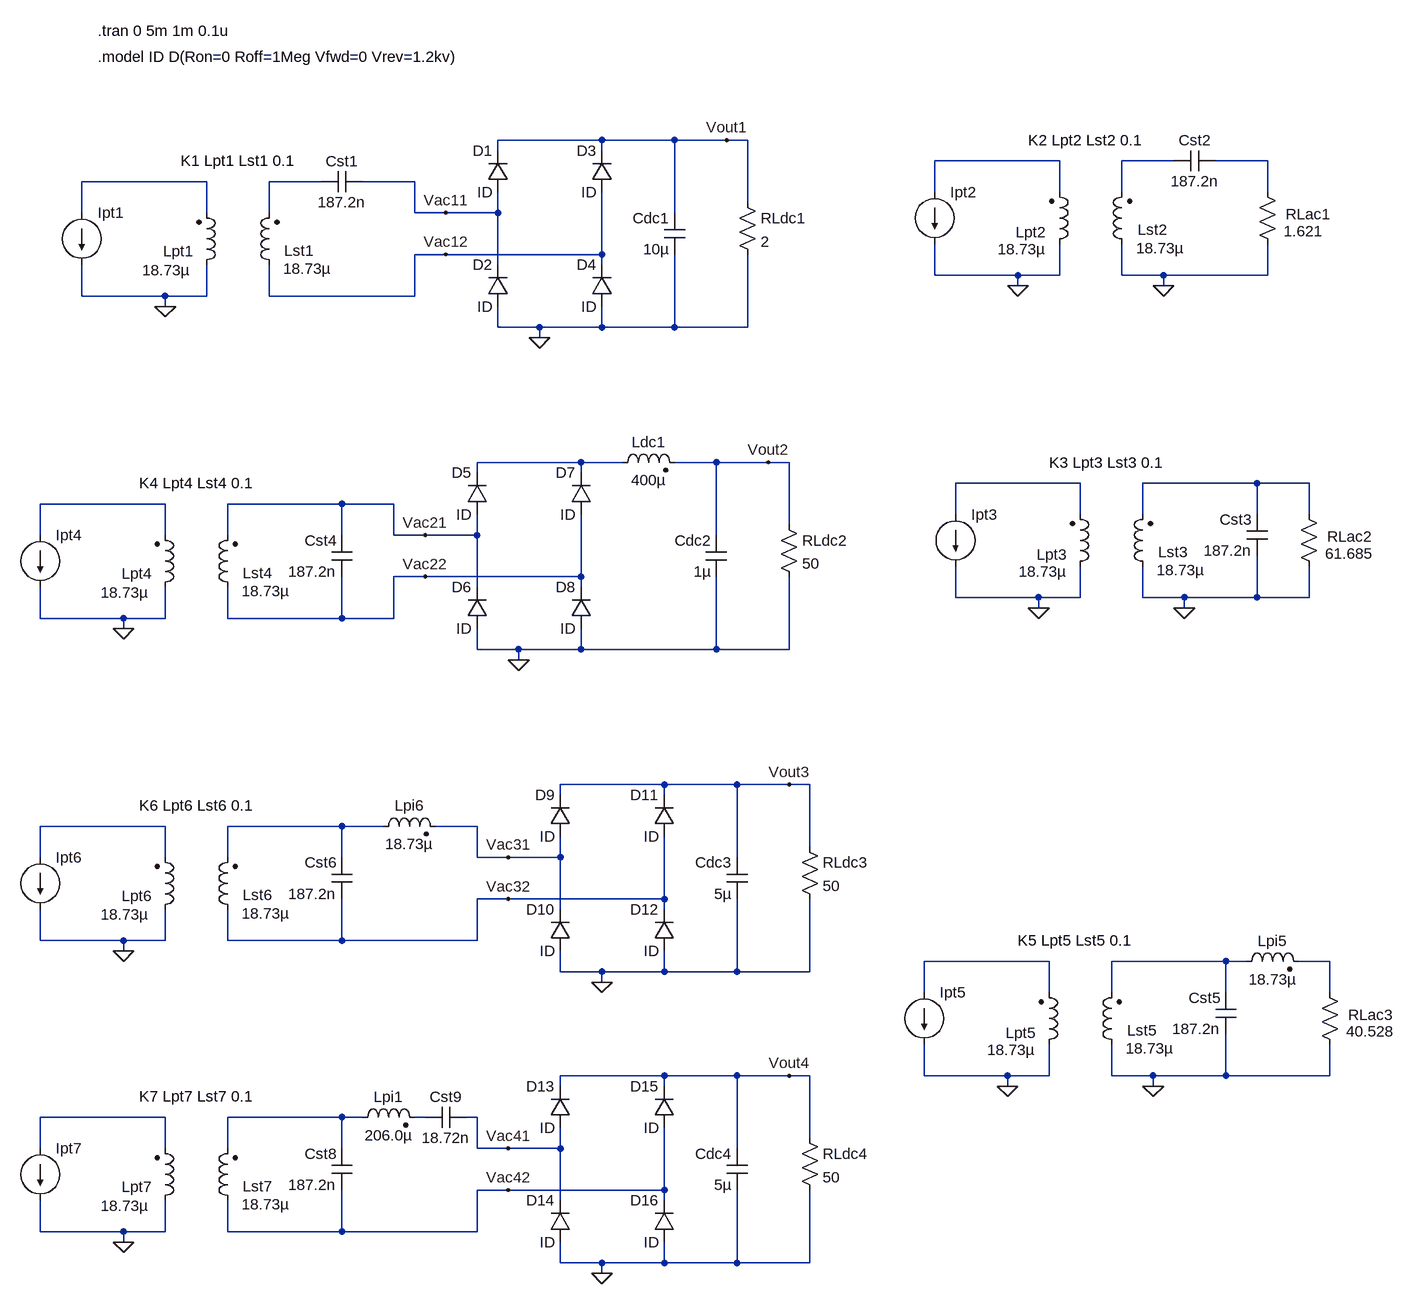
[diagram p0: schematic Rac.asc]
Rac.asc, the LTspice schematic file:
Version 4
SHEET 1 2108 1984
WIRE 800 224 640 224
WIRE 912 224 800 224
WIRE 992 224 912 224
WIRE 1024 224 992 224
WIRE 640 240 640 224
WIRE 800 240 800 224
WIRE 1504 256 1312 256
WIRE 1680 256 1600 256
WIRE 1824 256 1744 256
WIRE 192 288 0 288
WIRE 368 288 288 288
WIRE 512 288 432 288
WIRE 1312 304 1312 256
WIRE 1504 304 1504 256
WIRE 1600 304 1600 256
WIRE 1824 304 1824 256
WIRE 1024 320 1024 224
WIRE 0 336 0 288
WIRE 192 336 192 288
WIRE 288 336 288 288
WIRE 512 336 512 288
WIRE 560 336 512 336
WIRE 640 336 640 304
WIRE 640 336 560 336
WIRE 912 336 912 224
WIRE 560 400 512 400
WIRE 800 400 800 304
WIRE 800 400 560 400
WIRE 640 416 640 336
WIRE 800 416 800 400
WIRE 1312 432 1312 384
WIRE 1440 432 1312 432
WIRE 1504 432 1504 384
WIRE 1504 432 1440 432
WIRE 1600 432 1600 384
WIRE 1664 432 1600 432
WIRE 1824 432 1824 384
WIRE 1824 432 1664 432
WIRE 1440 448 1440 432
WIRE 1664 448 1664 432
WIRE 0 464 0 416
WIRE 128 464 0 464
WIRE 192 464 192 416
WIRE 192 464 128 464
WIRE 288 464 288 416
WIRE 512 464 512 400
WIRE 512 464 288 464
WIRE 128 480 128 464
WIRE 640 512 640 480
WIRE 704 512 640 512
WIRE 800 512 800 480
WIRE 800 512 704 512
WIRE 912 512 912 400
WIRE 912 512 800 512
WIRE 1024 512 1024 400
WIRE 1024 512 912 512
WIRE 704 528 704 512
WIRE 768 720 608 720
WIRE 832 720 768 720
WIRE 976 720 912 720
WIRE 1056 720 976 720
WIRE 1088 720 1056 720
WIRE 608 736 608 720
WIRE 768 736 768 720
WIRE 1536 752 1344 752
WIRE 1808 752 1632 752
WIRE 1888 752 1808 752
WIRE 128 784 -64 784
WIRE 400 784 224 784
WIRE 480 784 400 784
WIRE 1344 800 1344 752
WIRE 1536 800 1536 752
WIRE 1632 800 1632 752
WIRE 1808 800 1808 752
WIRE 1888 800 1888 752
WIRE 1088 816 1088 720
WIRE -64 832 -64 784
WIRE 128 832 128 784
WIRE 224 832 224 784
WIRE 400 832 400 784
WIRE 480 832 480 784
WIRE 528 832 480 832
WIRE 608 832 608 800
WIRE 608 832 528 832
WIRE 976 832 976 720
WIRE 528 896 480 896
WIRE 768 896 768 800
WIRE 768 896 528 896
WIRE 608 912 608 832
WIRE 768 912 768 896
WIRE 1344 928 1344 880
WIRE 1472 928 1344 928
WIRE 1536 928 1536 880
WIRE 1536 928 1472 928
WIRE 1632 928 1632 880
WIRE 1696 928 1632 928
WIRE 1808 928 1808 864
WIRE 1808 928 1696 928
WIRE 1888 928 1888 880
WIRE 1888 928 1808 928
WIRE 1472 944 1472 928
WIRE 1696 944 1696 928
WIRE -64 960 -64 912
WIRE 64 960 -64 960
WIRE 128 960 128 912
WIRE 128 960 64 960
WIRE 224 960 224 912
WIRE 400 960 400 896
WIRE 400 960 224 960
WIRE 480 960 480 896
WIRE 480 960 400 960
WIRE 64 976 64 960
WIRE 608 1008 608 976
WIRE 672 1008 608 1008
WIRE 768 1008 768 976
WIRE 768 1008 672 1008
WIRE 976 1008 976 896
WIRE 976 1008 768 1008
WIRE 1088 1008 1088 896
WIRE 1088 1008 976 1008
WIRE 672 1024 672 1008
WIRE 896 1216 736 1216
WIRE 1008 1216 896 1216
WIRE 1088 1216 1008 1216
WIRE 1120 1216 1088 1216
WIRE 736 1232 736 1216
WIRE 896 1232 896 1216
WIRE 128 1280 -64 1280
WIRE 400 1280 224 1280
WIRE 464 1280 400 1280
WIRE 608 1280 544 1280
WIRE 1120 1312 1120 1216
WIRE -64 1328 -64 1280
WIRE 128 1328 128 1280
WIRE 224 1328 224 1280
WIRE 400 1328 400 1280
WIRE 608 1328 608 1280
WIRE 656 1328 608 1328
WIRE 736 1328 736 1296
WIRE 736 1328 656 1328
WIRE 1008 1328 1008 1216
WIRE 656 1392 608 1392
WIRE 896 1392 896 1296
WIRE 896 1392 656 1392
WIRE 736 1408 736 1328
WIRE 896 1408 896 1392
WIRE -64 1456 -64 1408
WIRE 64 1456 -64 1456
WIRE 128 1456 128 1408
WIRE 128 1456 64 1456
WIRE 224 1456 224 1408
WIRE 400 1456 400 1392
WIRE 400 1456 224 1456
WIRE 608 1456 608 1392
WIRE 608 1456 400 1456
WIRE 64 1472 64 1456
WIRE 1488 1488 1296 1488
WIRE 1760 1488 1584 1488
WIRE 1792 1488 1760 1488
WIRE 1920 1488 1872 1488
WIRE 736 1504 736 1472
WIRE 800 1504 736 1504
WIRE 896 1504 896 1472
WIRE 896 1504 800 1504
WIRE 1008 1504 1008 1392
WIRE 1008 1504 896 1504
WIRE 1120 1504 1120 1392
WIRE 1120 1504 1008 1504
WIRE 800 1520 800 1504
WIRE 1296 1536 1296 1488
WIRE 1488 1536 1488 1488
WIRE 1584 1536 1584 1488
WIRE 1760 1536 1760 1488
WIRE 1920 1536 1920 1488
WIRE 896 1664 736 1664
WIRE 1008 1664 896 1664
WIRE 1088 1664 1008 1664
WIRE 1120 1664 1088 1664
WIRE 1296 1664 1296 1616
WIRE 1424 1664 1296 1664
WIRE 1488 1664 1488 1616
WIRE 1488 1664 1424 1664
WIRE 1584 1664 1584 1616
WIRE 1648 1664 1584 1664
WIRE 1760 1664 1760 1600
WIRE 1760 1664 1648 1664
WIRE 1920 1664 1920 1616
WIRE 1920 1664 1760 1664
WIRE 736 1680 736 1664
WIRE 896 1680 896 1664
WIRE 1424 1680 1424 1664
WIRE 1648 1680 1648 1664
WIRE 128 1728 -64 1728
WIRE 400 1728 224 1728
WIRE 432 1728 400 1728
WIRE 528 1728 512 1728
WIRE 608 1728 592 1728
WIRE 1120 1760 1120 1664
WIRE -64 1776 -64 1728
WIRE 128 1776 128 1728
WIRE 224 1776 224 1728
WIRE 400 1776 400 1728
WIRE 608 1776 608 1728
WIRE 656 1776 608 1776
WIRE 736 1776 736 1744
WIRE 736 1776 656 1776
WIRE 1008 1776 1008 1664
WIRE 656 1840 608 1840
WIRE 896 1840 896 1744
WIRE 896 1840 656 1840
WIRE 736 1856 736 1776
WIRE 896 1856 896 1840
WIRE -64 1904 -64 1856
WIRE 64 1904 -64 1904
WIRE 128 1904 128 1856
WIRE 128 1904 64 1904
WIRE 224 1904 224 1856
WIRE 400 1904 400 1840
WIRE 400 1904 224 1904
WIRE 608 1904 608 1840
WIRE 608 1904 400 1904
WIRE 64 1920 64 1904
WIRE 736 1952 736 1920
WIRE 800 1952 736 1952
WIRE 896 1952 896 1920
WIRE 896 1952 800 1952
WIRE 1008 1952 1008 1840
WIRE 1008 1952 896 1952
WIRE 1120 1952 1120 1840
WIRE 1120 1952 1008 1952
WIRE 800 1968 800 1952
FLAG 1440 448 0
FLAG 1664 448 0
FLAG 128 480 0
FLAG 704 528 0
FLAG 992 224 Vout1
FLAG 560 336 Vac11
FLAG 560 400 Vac12
FLAG 1472 944 0
FLAG 1696 944 0
FLAG 64 976 0
FLAG 672 1024 0
FLAG 1056 720 Vout2
FLAG 528 832 Vac21
FLAG 528 896 Vac22
FLAG 1424 1680 0
FLAG 1648 1680 0
FLAG 64 1472 0
FLAG 800 1520 0
FLAG 1088 1216 Vout3
FLAG 656 1328 Vac31
FLAG 656 1392 Vac32
FLAG 64 1920 0
FLAG 800 1968 0
FLAG 1088 1664 Vout4
FLAG 656 1776 Vac41
FLAG 656 1840 Vac42
SYMBOL ind2 1488 400 M180
WINDOW 0 -51 34 Left 2
WINDOW 3 -79 8 Left 2
SYMATTR InstName Lpt2
SYMATTR Value 18.73µ
SYMATTR Type ind
SYMBOL ind2 1616 400 R180
WINDOW 0 -54 38 Left 2
WINDOW 3 -80 10 Left 2
SYMATTR InstName Lst2
SYMATTR Value 18.73µ
SYMATTR Type ind
SYMATTR SpiceLine Rser=10m
SYMBOL current 1312 304 R0
WINDOW 3 24 80 Invisible 2
SYMATTR Value SINE(0 14.14 85k 0 0 0)
SYMATTR InstName Ipt2
SYMBOL res 1808 288 R0
WINDOW 0 44 50 Left 2
WINDOW 3 41 76 Left 2
SYMATTR InstName RLac1
SYMATTR Value 1.621
SYMBOL cap 1744 240 R90
WINDOW 0 0 32 VBottom 2
WINDOW 3 32 32 VTop 2
SYMATTR InstName Cst2
SYMATTR Value 187.2n
SYMBOL ind2 176 432 M180
WINDOW 0 -51 37 Left 2
WINDOW 3 -83 8 Left 2
SYMATTR InstName Lpt1
SYMATTR Value 18.73µ
SYMATTR Type ind
SYMBOL ind2 304 432 R180
WINDOW 0 -53 38 Left 2
WINDOW 3 -80 10 Left 2
SYMATTR InstName Lst1
SYMATTR Value 18.73µ
SYMATTR Type ind
SYMATTR SpiceLine Rser=10m
SYMBOL current 0 336 R0
WINDOW 3 24 80 Invisible 2
SYMATTR Value SINE(0 14.14 85k 0 0 0)
SYMATTR InstName Ipt1
SYMBOL cap 432 272 R90
WINDOW 0 0 32 VBottom 2
WINDOW 3 32 32 VTop 2
SYMATTR InstName Cst1
SYMATTR Value 187.2n
SYMBOL diode 656 304 R180
WINDOW 0 24 64 Left 2
WINDOW 3 24 0 Left 2
SYMATTR InstName D1
SYMATTR Value ID
SYMBOL diode 656 480 R180
WINDOW 0 24 64 Left 2
WINDOW 3 24 0 Left 2
SYMATTR InstName D2
SYMATTR Value ID
SYMBOL diode 816 304 R180
WINDOW 0 24 64 Left 2
WINDOW 3 24 0 Left 2
SYMATTR InstName D3
SYMATTR Value ID
SYMBOL diode 816 480 R180
WINDOW 0 24 64 Left 2
WINDOW 3 24 0 Left 2
SYMATTR InstName D4
SYMATTR Value ID
SYMBOL cap 928 400 R180
WINDOW 0 24 56 Left 2
WINDOW 3 24 8 Left 2
SYMATTR InstName Cdc1
SYMATTR Value 10µ
SYMBOL res 1008 304 R0
SYMATTR InstName RLdc1
SYMATTR Value 2
SYMBOL ind2 1520 896 M180
WINDOW 0 -51 34 Left 2
WINDOW 3 -79 8 Left 2
SYMATTR InstName Lpt3
SYMATTR Value 18.73µ
SYMATTR Type ind
SYMBOL ind2 1648 896 R180
WINDOW 0 -54 38 Left 2
WINDOW 3 -80 10 Left 2
SYMATTR InstName Lst3
SYMATTR Value 18.73µ
SYMATTR Type ind
SYMATTR SpiceLine Rser=10m
SYMBOL current 1344 800 R0
WINDOW 3 24 80 Invisible 2
SYMATTR Value SINE(0 14.14 85k 0 0 0)
SYMATTR InstName Ipt3
SYMBOL res 1872 784 R0
WINDOW 0 44 50 Left 2
WINDOW 3 41 76 Left 2
SYMATTR InstName RLac2
SYMATTR Value 61.685
SYMBOL cap 1824 864 R180
WINDOW 0 24 56 Left 2
WINDOW 3 24 8 Left 2
SYMATTR InstName Cst3
SYMATTR Value 187.2n
SYMBOL ind2 112 928 M180
WINDOW 0 -51 37 Left 2
WINDOW 3 -83 8 Left 2
SYMATTR InstName Lpt4
SYMATTR Value 18.73µ
SYMATTR Type ind
SYMBOL ind2 240 928 R180
WINDOW 0 -53 38 Left 2
WINDOW 3 -80 10 Left 2
SYMATTR InstName Lst4
SYMATTR Value 18.73µ
SYMATTR Type ind
SYMATTR SpiceLine Rser=10m
SYMBOL current -64 832 R0
WINDOW 3 24 80 Invisible 2
SYMATTR Value SINE(0 14.14 85k 0 0 0)
SYMATTR InstName Ipt4
SYMBOL cap 416 896 R180
WINDOW 0 24 56 Left 2
WINDOW 3 24 8 Left 2
SYMATTR InstName Cst4
SYMATTR Value 187.2n
SYMBOL diode 624 800 R180
WINDOW 0 24 64 Left 2
WINDOW 3 24 0 Left 2
SYMATTR InstName D5
SYMATTR Value ID
SYMBOL diode 624 976 R180
WINDOW 0 24 64 Left 2
WINDOW 3 24 0 Left 2
SYMATTR InstName D6
SYMATTR Value ID
SYMBOL diode 784 800 R180
WINDOW 0 24 64 Left 2
WINDOW 3 24 0 Left 2
SYMATTR InstName D7
SYMATTR Value ID
SYMBOL diode 784 976 R180
WINDOW 0 24 64 Left 2
WINDOW 3 24 0 Left 2
SYMATTR InstName D8
SYMATTR Value ID
SYMBOL cap 992 896 R180
WINDOW 0 24 56 Left 2
WINDOW 3 24 8 Left 2
SYMATTR InstName Cdc2
SYMATTR Value 1µ
SYMBOL res 1072 800 R0
SYMATTR InstName RLdc2
SYMATTR Value 50
SYMBOL ind2 816 736 R270
WINDOW 0 32 56 VTop 2
WINDOW 3 4 56 VBottom 2
SYMATTR InstName Ldc1
SYMATTR Value 400µ
SYMATTR Type ind
SYMBOL ind2 1472 1632 M180
WINDOW 0 -51 34 Left 2
WINDOW 3 -79 8 Left 2
SYMATTR InstName Lpt5
SYMATTR Value 18.73µ
SYMATTR Type ind
SYMBOL ind2 1600 1632 R180
WINDOW 0 -54 38 Left 2
WINDOW 3 -80 10 Left 2
SYMATTR InstName Lst5
SYMATTR Value 18.73µ
SYMATTR Type ind
SYMATTR SpiceLine Rser=10m
SYMBOL current 1296 1536 R0
WINDOW 3 24 80 Invisible 2
SYMATTR Value SINE(0 14.14 85k 0 0 0)
SYMATTR InstName Ipt5
SYMBOL res 1904 1520 R0
WINDOW 0 44 50 Left 2
WINDOW 3 41 76 Left 2
SYMATTR InstName RLac3
SYMATTR Value 40.528
SYMBOL cap 1776 1600 R180
WINDOW 0 24 56 Left 2
WINDOW 3 24 8 Left 2
SYMATTR InstName Cst5
SYMATTR Value 187.2n
SYMBOL ind2 112 1424 M180
WINDOW 0 -51 37 Left 2
WINDOW 3 -83 8 Left 2
SYMATTR InstName Lpt6
SYMATTR Value 18.73µ
SYMATTR Type ind
SYMBOL ind2 240 1424 R180
WINDOW 0 -53 38 Left 2
WINDOW 3 -80 10 Left 2
SYMATTR InstName Lst6
SYMATTR Value 18.73µ
SYMATTR Type ind
SYMATTR SpiceLine Rser=10m
SYMBOL current -64 1328 R0
WINDOW 3 24 80 Invisible 2
SYMATTR Value SINE(0 14.14 85k 0 0 0)
SYMATTR InstName Ipt6
SYMBOL cap 416 1392 R180
WINDOW 0 24 56 Left 2
WINDOW 3 24 8 Left 2
SYMATTR InstName Cst6
SYMATTR Value 187.2n
SYMBOL diode 752 1296 R180
WINDOW 0 24 64 Left 2
WINDOW 3 24 0 Left 2
SYMATTR InstName D9
SYMATTR Value ID
SYMBOL diode 752 1472 R180
WINDOW 0 24 64 Left 2
WINDOW 3 24 0 Left 2
SYMATTR InstName D10
SYMATTR Value ID
SYMBOL diode 912 1296 R180
WINDOW 0 24 64 Left 2
WINDOW 3 24 0 Left 2
SYMATTR InstName D11
SYMATTR Value ID
SYMBOL diode 912 1472 R180
WINDOW 0 24 64 Left 2
WINDOW 3 24 0 Left 2
SYMATTR InstName D12
SYMATTR Value ID
SYMBOL cap 1024 1392 R180
WINDOW 0 24 56 Left 2
WINDOW 3 24 8 Left 2
SYMATTR InstName Cdc3
SYMATTR Value 5µ
SYMBOL res 1104 1296 R0
SYMATTR InstName RLdc3
SYMATTR Value 50
SYMBOL ind2 448 1296 R270
WINDOW 0 32 56 VTop 2
WINDOW 3 4 56 VBottom 2
SYMATTR InstName Lpi6
SYMATTR Value 18.73µ
SYMATTR Type ind
SYMBOL ind2 1776 1504 R270
WINDOW 0 32 56 VTop 2
WINDOW 3 4 56 VBottom 2
SYMATTR InstName Lpi5
SYMATTR Value 18.73µ
SYMATTR Type ind
SYMBOL ind2 112 1872 M180
WINDOW 0 -51 37 Left 2
WINDOW 3 -83 8 Left 2
SYMATTR InstName Lpt7
SYMATTR Value 18.73µ
SYMATTR Type ind
SYMBOL ind2 240 1872 R180
WINDOW 0 -53 38 Left 2
WINDOW 3 -80 10 Left 2
SYMATTR InstName Lst7
SYMATTR Value 18.73µ
SYMATTR Type ind
SYMATTR SpiceLine Rser=10m
SYMBOL current -64 1776 R0
WINDOW 3 24 80 Invisible 2
SYMATTR Value SINE(0 14.14 85k 0 0 0)
SYMATTR InstName Ipt7
SYMBOL cap 416 1840 R180
WINDOW 0 24 56 Left 2
WINDOW 3 24 8 Left 2
SYMATTR InstName Cst8
SYMATTR Value 187.2n
SYMBOL diode 752 1744 R180
WINDOW 0 24 64 Left 2
WINDOW 3 24 0 Left 2
SYMATTR InstName D13
SYMATTR Value ID
SYMBOL diode 752 1920 R180
WINDOW 0 24 64 Left 2
WINDOW 3 24 0 Left 2
SYMATTR InstName D14
SYMATTR Value ID
SYMBOL diode 912 1744 R180
WINDOW 0 24 64 Left 2
WINDOW 3 24 0 Left 2
SYMATTR InstName D15
SYMATTR Value ID
SYMBOL diode 912 1920 R180
WINDOW 0 24 64 Left 2
WINDOW 3 24 0 Left 2
SYMATTR InstName D16
SYMATTR Value ID
SYMBOL cap 1024 1840 R180
WINDOW 0 24 56 Left 2
WINDOW 3 24 8 Left 2
SYMATTR InstName Cdc4
SYMATTR Value 5µ
SYMBOL res 1104 1744 R0
SYMATTR InstName RLdc4
SYMATTR Value 50
SYMBOL ind2 416 1744 R270
WINDOW 0 32 56 VTop 2
WINDOW 3 4 56 VBottom 2
SYMATTR InstName Lpi1
SYMATTR Value 206.0µ
SYMATTR Type ind
SYMBOL cap 528 1744 R270
WINDOW 0 32 32 VTop 2
WINDOW 3 0 32 VBottom 2
SYMATTR InstName Cst9
SYMATTR Value 18.72n
TEXT 1456 224 Left 2 !K2 Lpt2 Lst2 0.1
TEXT 24 56 Left 2 !.tran 0 5m 1m 0.1u
TEXT 152 256 Left 2 !K1 Lpt1 Lst1 0.1
TEXT 24 96 Left 2 !.model ID D(Ron=0 Roff=1Meg Vfwd=0 Vrev=1.2kv)
TEXT 1488 720 Left 2 !K3 Lpt3 Lst3 0.1
TEXT 88 752 Left 2 !K4 Lpt4 Lst4 0.1
TEXT 1440 1456 Left 2 !K5 Lpt5 Lst5 0.1
TEXT 88 1248 Left 2 !K6 Lpt6 Lst6 0.1
TEXT 88 1696 Left 2 !K7 Lpt7 Lst7 0.1

The netlist it stands for:
* Rac.asc
Lpt2 0 N001 18.73µ
Lst2 0 N002 18.73µ Rser=10m
Ipt2 N001 0 SINE(0 14.14 85k 0 0 0)
RLac1 N003 0 1.621
Cst2 N003 N002 187.2n
Lpt1 0 N004 18.73µ
Lst1 Vac12 N005 18.73µ Rser=10m
Ipt1 N004 0 SINE(0 14.14 85k 0 0 0)
Cst1 Vac11 N005 187.2n
D1 Vac11 Vout1 ID
D2 0 Vac11 ID
D3 Vac12 Vout1 ID
D4 0 Vac12 ID
Cdc1 0 Vout1 10µ
RLdc1 Vout1 0 2
Lpt3 0 N007 18.73µ
Lst3 0 N008 18.73µ Rser=10m
Ipt3 N007 0 SINE(0 14.14 85k 0 0 0)
RLac2 N008 0 61.685
Cst3 0 N008 187.2n
Lpt4 0 N009 18.73µ
Lst4 Vac22 Vac21 18.73µ Rser=10m
Ipt4 N009 0 SINE(0 14.14 85k 0 0 0)
Cst4 Vac22 Vac21 187.2n
D5 Vac21 N006 ID
D6 0 Vac21 ID
D7 Vac22 N006 ID
D8 0 Vac22 ID
Cdc2 0 Vout2 1µ
RLdc2 Vout2 0 50
Ldc1 N006 Vout2 400µ
Lpt5 0 N012 18.73µ
Lst5 0 N013 18.73µ Rser=10m
Ipt5 N012 0 SINE(0 14.14 85k 0 0 0)
RLac3 N014 0 40.528
Cst5 0 N013 187.2n
Lpt6 0 N010 18.73µ
Lst6 Vac32 N011 18.73µ Rser=10m
Ipt6 N010 0 SINE(0 14.14 85k 0 0 0)
Cst6 Vac32 N011 187.2n
D9 Vac31 Vout3 ID
D10 0 Vac31 ID
D11 Vac32 Vout3 ID
D12 0 Vac32 ID
Cdc3 0 Vout3 5µ
RLdc3 Vout3 0 50
Lpi6 N011 Vac31 18.73µ
Lpi5 N013 N014 18.73µ
Lpt7 0 N015 18.73µ
Lst7 Vac42 N016 18.73µ Rser=10m
Ipt7 N015 0 SINE(0 14.14 85k 0 0 0)
Cst8 Vac42 N016 187.2n
D13 Vac41 Vout4 ID
D14 0 Vac41 ID
D15 Vac42 Vout4 ID
D16 0 Vac42 ID
Cdc4 0 Vout4 5µ
RLdc4 Vout4 0 50
Lpi1 N016 N017 206.0µ
Cst9 N017 Vac41 18.72n
.model D D
.lib standard.dio
K2 Lpt2 Lst2 0.1
.tran 0 5m 1m 0.1u
K1 Lpt1 Lst1 0.1
.model ID D(Ron=0 Roff=1Meg Vfwd=0 Vrev=1.2kv)
K3 Lpt3 Lst3 0.1
K4 Lpt4 Lst4 0.1
K5 Lpt5 Lst5 0.1
K6 Lpt6 Lst6 0.1
K7 Lpt7 Lst7 0.1
.backanno
.end